# EAGLE design Charger (EAGLE 9.4.2)
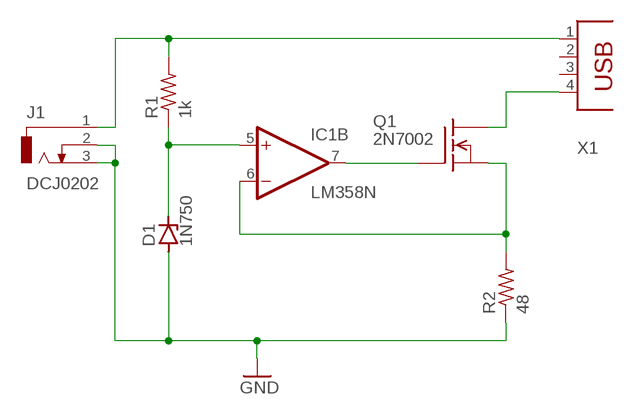
[diagram p0: schematic, sheet 1]

## Parts
D1  1N750  ZENER-DIODEDO35Z10  [DO35Z10]
IC1  LM358N  [DIL08]
J1  DCJ0202  [DCJ0202]
Q1  2N7002  TN0602N3  [TO-92]
R1  1k  R-US_0204/7  [0204/7]
R2  48  R-US_0204/7  [0204/7]
X1  PN87520  [PN87520]

## Nets
GND: D1.A J1.2 J1.3 R2.1
N$4: IC1.6(B:-IN) Q1.1(S) R2.2
N$5: D1.C IC1.5(B:+IN) R1.1
N$7: IC1.7(B:OUT) Q1.2(G)
N$10: Q1.3(D) X1.4
V+: J1.1 R1.2 X1.1
Unconnected: IC1.1(A:OUT) IC1.2(A:-IN) IC1.3(A:+IN) X1.2 X1.3

## Power pins joined to a net without a drawn wire
GND: IC1.4(P:V-)
V+: IC1.8(P:V+)

## Library data of the parts
D1 = diode:ZENER-DIODE: Z-Diode
IC1 = linear:LM358: OP AMP also LM158; LM258; LM2904 Source: http://cache.national.com/ds/LM/LM158.pdf
J1 = con-jack:DCJ0202: DC POWER JACK Source: DCJ0202.pdf; OC_FARNELL: unknown; OC_NEWARK: unknown
Q1 = transistor-fet:TN0602N3: N-Channel Enhancement MOSFET 20V; 4A; 0,75Ohm
R1 R2 = rcl:R-US_: RESISTOR, American symbol; SPICEPREFIX: R
X1 = con-berg:PN87520: BERG USB connector; OC_FARNELL: unknown; OC_NEWARK: unknown

## Board
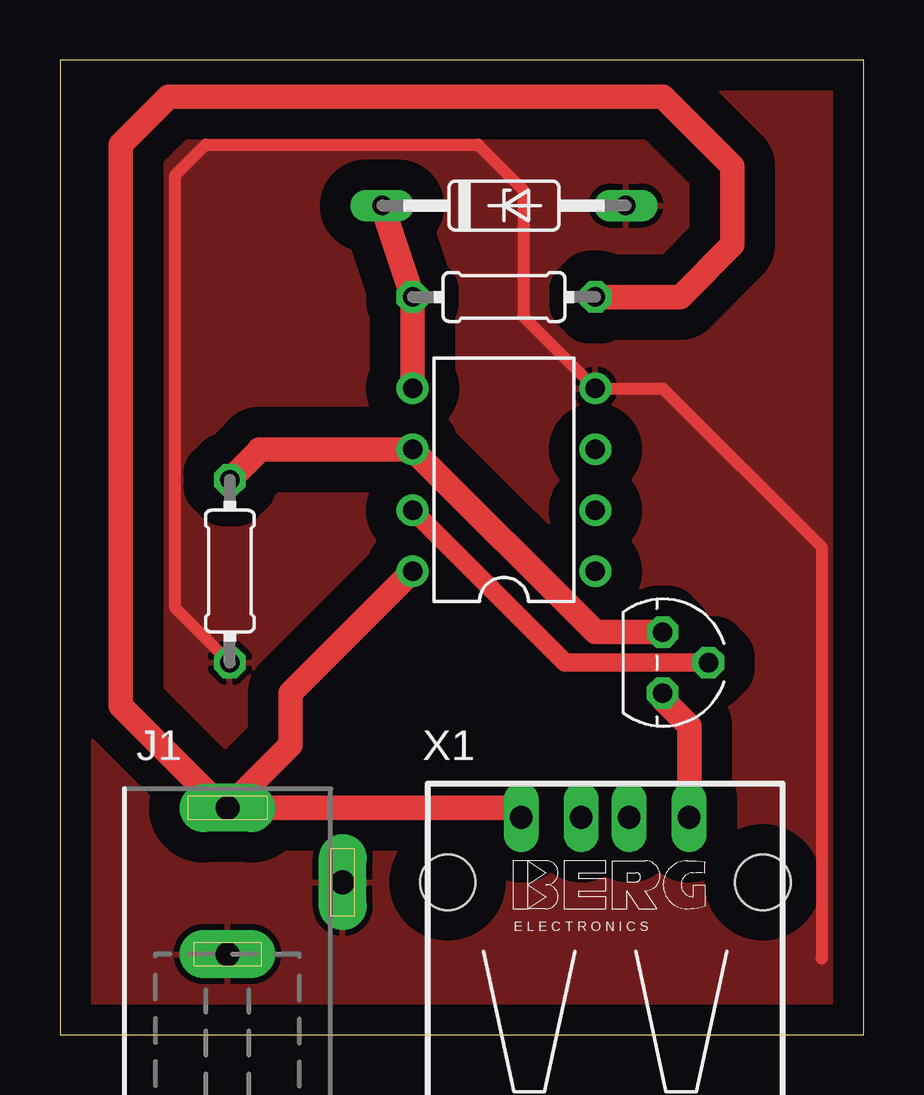
[diagram p1: board, top side]

Size 33.5 x 40.63 mm. Coordinates in mm from the lower left corner, seen from the top.
Outline: 0,0 33.5,0 33.5,40.63 0,40.63 0,0
Copper layers (1*16): Top 0.035mm / dielectric 1.5mm / Bottom 0.035mm
Design rules "default": minimum track width 6mil, minimum drill 0.35mm, track to track 6mil, track to pad 6mil, pad to pad 6mil, via to via 6mil, smd to smd 6mil, copper to edge 40mil, drill to drill 6mil, minimum pad ring 10mil, minimum via ring 8mil, stop-mask expansion 4mil, vias tented up to drill 0mil, thermal gap 10mil

### Footprints (pad centres in the part's own frame; a part is rotated, then mirrored left to right if it is on the bottom)
DO35Z10 = drill 0.813 long: A 5.08,0; C -5.08,0
DIL08 = drill 0.813 pad 1.27: 1 -3.81,-3.81; 2 -1.27,-3.81; 3 1.27,-3.81; 4 3.81,-3.81; 5 3.81,3.81; 6 1.27,3.81; 7 -1.27,3.81; 8 -3.81,3.81
DCJ0202 = drill 1 pad 2 long: 1 0,3.1; 2 4.8,0; 3 0,-3
TO-92 = drill 0.813 octagon: 1 -1.27,0; 2 0,1.905; 3 1.27,0
0204/7 = drill 0.813 octagon: 1 -3.81,0; 2 3.81,0
PN87520 = drill 0.95 long: 1 -3.5,2.71; 2 -1,2.71; 3 1,2.71; 4 3.5,2.71 | hole 2.3: -6.57,0; 6.57,0

### Placement (x,y rotation side)
D1  18.51,34.56 0 top
IC1  18.51,23.13 90 top
J1  6.99,6.35 0 top
Q1  25.13,15.51 270 top
R1  18.51,30.75 0 top
R2  7.08,19.32 90 top
X1  22.73,6.35 0 top

### Tracks (layer width: path | path; a pad name or v marks a point on that pad's centre or on a via)
GND
  Top 0.152: IC1.4 22.38,27
  Top 0.508: 31.75,3.17 31.75,20.32 25.13,26.94 IC1.4 19.32,29.94 19.32,35.21 17.43,37.1 6.08,37.1 4.81,35.83 4.81,17.78 R2.1
  pour Top (isolate 1.27): 0.36,40.27 32.91,40.27 32.91,0.64 0.36,0.64
N$4
  Top 0.508: 8.31,24.36 8.31,24.4
  Top 1.016: R2.2 8.31,24.36 | 8.31,24.4 IC1.6 22.32,16.78 Q1.1
N$5
  Top 1.016: D1.C R1.1 IC1.5
N$7
  Top 0.762: Q1.2 21.05,15.51 IC1.7
N$10
  Top 1.016: X1.4 26.23,12.87 25.13,13.97 Q1.3
V+
  Top 0.508: X1.1 18.84,9.45
  Top 1.016: IC1.8 9.62,14.24 9.62,12.09 J1.1 | R1.2 25.86,30.75 28.04,32.92 28.04,36.2 25.13,39.1 4.54,39.1 2.54,37.1 2.54,13.7 6.79,9.45 J1.1 | 18.84,9.45 J1.1